# Altium schematic sheet COVER PAGE.SchDoc: COVER PAGE
size 420 x 297 mm; Date: March 14; CheckedBy: ThS. Bùi Quốc Bảo; DrawnBy: Nguyễn Gia Huy; Revision: 1.0; SheetNumber: 1; SheetTotal: 5; MasterProject: 2LEDs Dice game; Sub-system: 2LED_Dice.PrjPcb
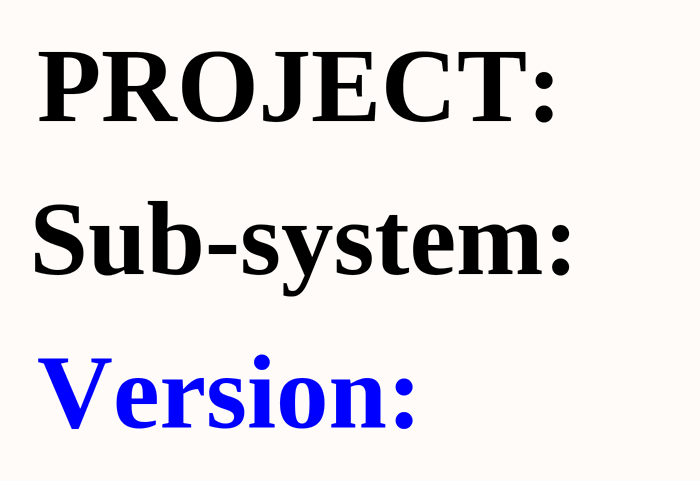
[diagram p0: COVER PAGE.SchDoc]

## Notes on the sheet
- PROJECT:
- Sub-system:
- Version:
- Project:
- Design by:
- Sheet title:
- Sheet
- of
- Checked by:
- Approved by:
- Doc No:
- Revision:
- Size:
- Dates:
- A3